# EAGLE design SparkFun_Noisy_Cricket (EAGLE 7.7.0)
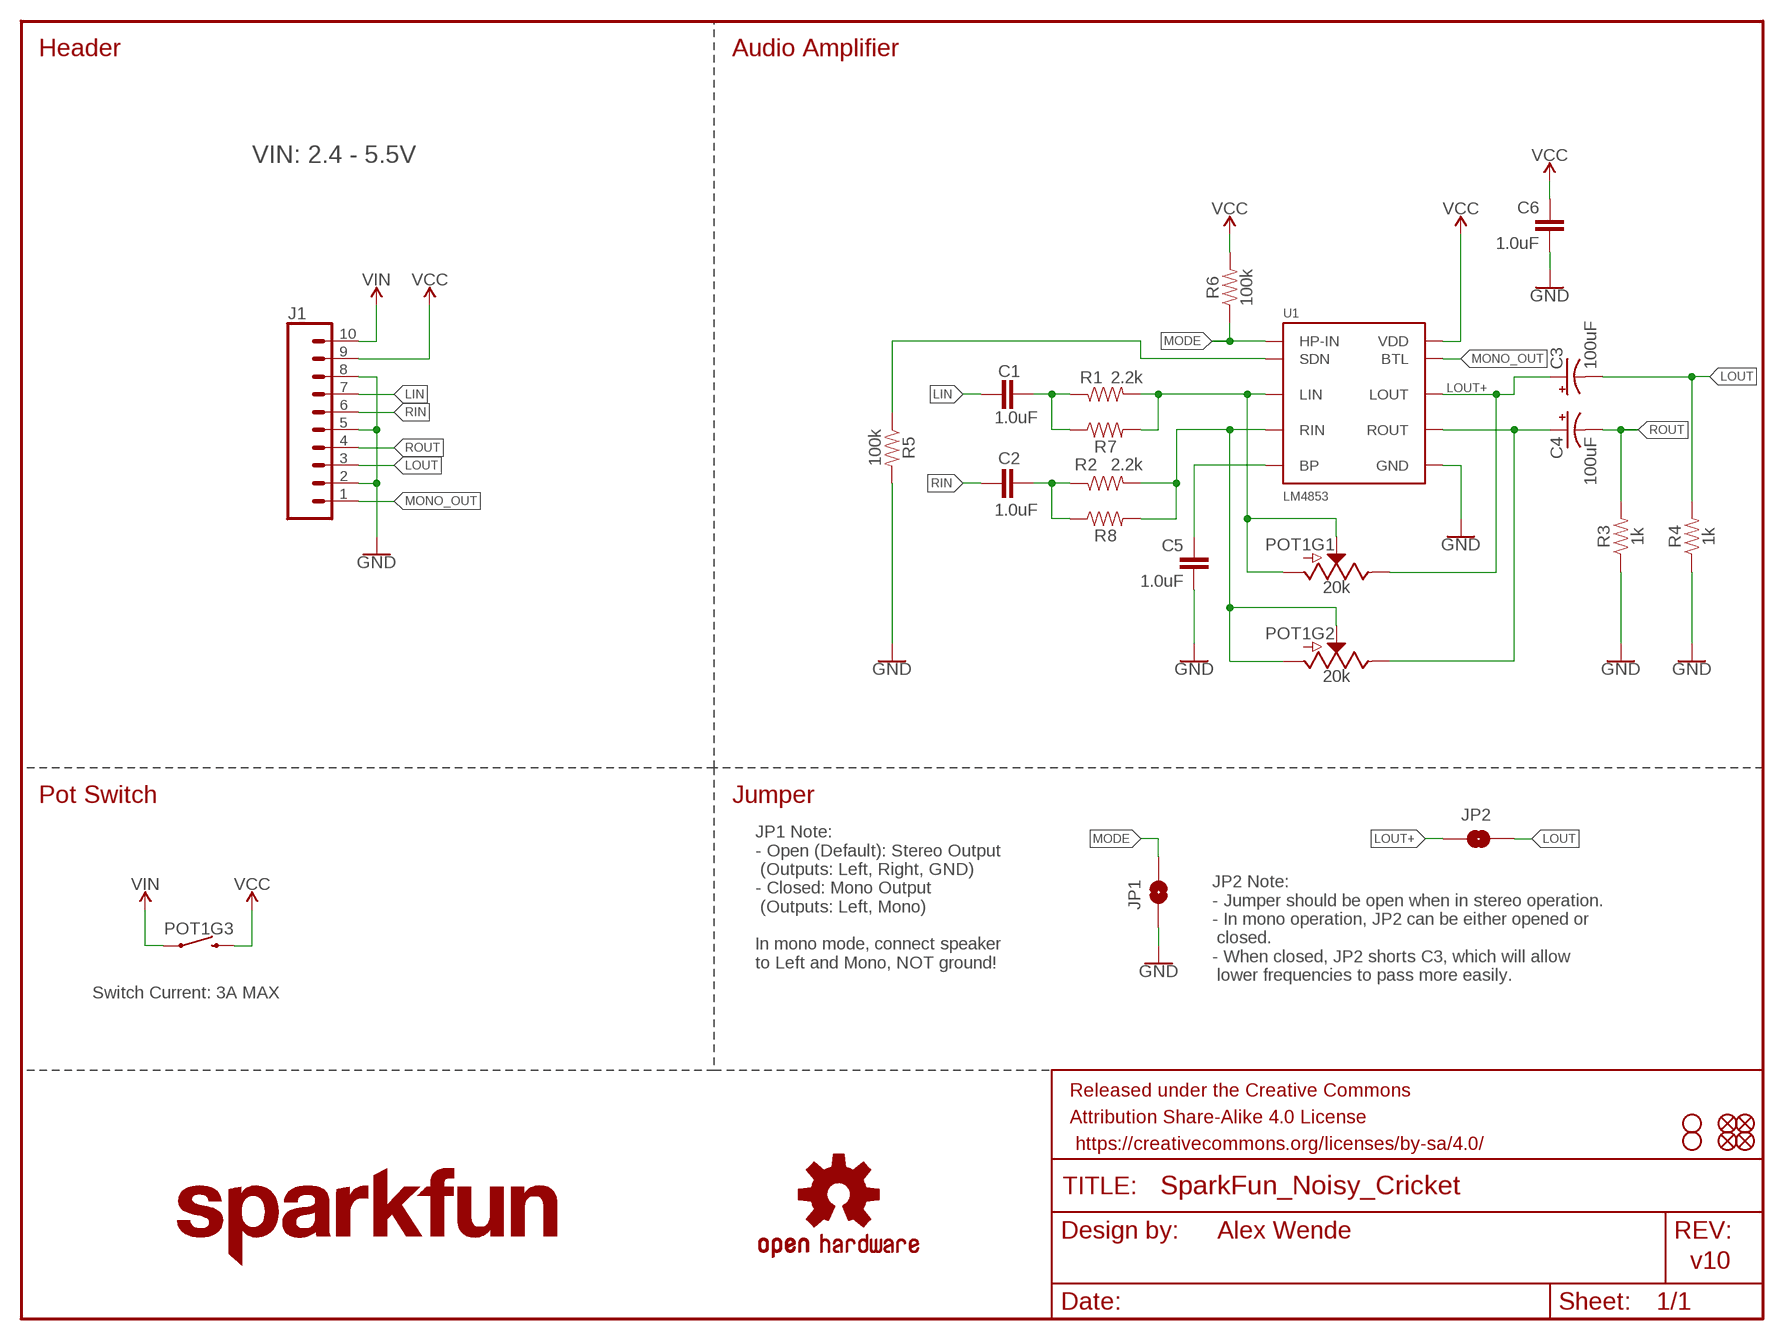
[diagram p0: schematic, sheet 1]

## Parts
C1  1.0uF  1.0UF-0603-16V-10%-X7R  [0603]
C2  1.0uF  1.0UF-0603-16V-10%-X7R  [0603]
C3  100uF  100UF-POLAR-25V-20%(ELEC)  [PANASONIC_D]
C4  100uF  100UF-POLAR-25V-20%(ELEC)  [PANASONIC_D]
C5  1.0uF  1.0UF-0603-16V-10%-X7R  [0603]
C6  1.0uF  1.0UF-0603-16V-10%-X7R  [0603]
FD1  FIDUCIALUFIDUCIAL  [FIDUCIAL-MICRO]
FD2  FIDUCIALUFIDUCIAL  [FIDUCIAL-MICRO]
FD3  FIDUCIALUFIDUCIAL  [FIDUCIAL-MICRO]
FD4  FIDUCIALUFIDUCIAL  [FIDUCIAL-MICRO]
FRAME1  FRAME-LETTER  [CREATIVE_COMMONS]
H1  STAND-OFF  [STAND-OFF]
H2  STAND-OFF  [STAND-OFF]
J1  CONN_10NO_SILK_PTH_FEMALE  [1X10_NO_SILK]
JP1  JUMPER-SMT_2_NO_NO-SILK  [SMT-JUMPER_2_NO_NO-SILK]
JP2  JUMPER-SMT_2_NO_NO-SILK  [SMT-JUMPER_2_NO_NO-SILK]
LOGO1  SFE_LOGO_NAME.1_INCH  [SFE_LOGO_NAME_.1]
LOGO2  OSHW-LOGOS  [OSHW-LOGO-S]
POT1  20k  POTENTIOMETER_DUAL_W/SWITCH  [POT-DUAL-SWITCH-PTH]
R1  2.2k  2.2KOHM-0603-1/10W-1%  [0603]
R2  2.2k  2.2KOHM-0603-1/10W-1%  [0603]
R3  1k  1KOHM-0603-1/10W-1%  [0603]
R4  1k  1KOHM-0603-1/10W-1%  [0603]
R5  100k  100KOHM-0603-1/10W-1%  [0603]
R6  100k  100KOHM-0603-1/10W-1%  [0603]
R7  RESISTORAXIAL-0.3-KIT  [AXIAL-0.3-KIT]
R8  RESISTORAXIAL-0.3-KIT  [AXIAL-0.3-KIT]
U1  LM4853  [TFSOP-10]

## Nets
5V: C6.1 J1.9 POT1.SW2 R6.2 U1.VDD ; supply symbol labelled VCC
GND: C5.2 C6.2 J1.2 J1.5 J1.8 JP1.1 R3.1 R4.1 R5.2 U1.GND
LIN: C1.1 J1.7
LOUT: C3.- J1.3 JP2.2 R4.2
LOUT+: C3.+ JP2.1 POT1.A3(E) U1.LOUT
MODE: JP1.2 R6.1 U1.HP-IN
MONO_OUT: J1.1 U1.BTL
N$3: C1.2 R1.1 R7.P$1
N$5: C5.1 U1.BP
N$6: C2.2 R2.1 R8.P$1
N$9: R5.1 U1.SDN
N$12: C4.+ POT1.B3(E) U1.ROUT
N$21: POT1.A1(A) POT1.A2(S) R1.2 R7.P$2 U1.LIN
N$24: POT1.B1(A) POT1.B2(S) R2.2 R8.P$2 U1.RIN
RIN: C2.1 J1.6
ROUT: C4.- J1.4 R3.2
VIN: J1.10 POT1.SW1

## Notes on the sheet
- Header | Audio Amplifier
- VIN: 2.4 - 5.5V
- Pot Switch | Jumper
- JP1 Note:
  - Open (Default): Stereo Output
   (Outputs: Left, Right, GND)
  - Closed: Mono Output
   (Outputs: Left, Mono)
  
  In mono mode, connect speaker 
  to Left and Mono, NOT ground!
- JP2 Note:
  - Jumper should be open when in stereo operation.
  - In mono operation, JP2 can be either opened or
   closed.
  - When closed, JP2 shorts C3, which will allow
   lower frequencies to pass more easily.
- Switch Current: 3A MAX
- Alex Wende
- v10

## Library data of the parts
C1 C2 C5 C6 = SparkFun-Capacitors:1.0UF: 1µF ceramic capacitors A capacitor is a passive two-terminal electrical component used to store electrical energy temporarily in an electric field.; PROD_ID: CAP-13930
C3 C4 = SparkFun-Capacitors:100UF-POLAR: 100µF polarized capacitors A capacitor is a passive two-terminal electrical component used to store electrical energy temporarily in an electric field.; PROD_ID: CAP-12547
FD1-FD4 = SparkFun-Aesthetics:FIDUCIAL: Fiducial Alignment Points Point-of-reference for pick-and-place machines and other optical instruments.
FRAME1 = SparkFun-Aesthetics:FRAME-LETTER: Schematic Frame - Letter Standard 8.5x11 US Letter frame
H1 H2 = SparkFun-Hardware:STAND-OFF: Stand Off Drill holes for mechanically mounting via screws, standoffs, etc. Note: Use the keepout ring to avoid running the screw head into surrounding components. Variant Overviews STAND-OFF - Mechanical footprint for a #4 phillips button head screw. STAND-OFF-TIGHT - Mechanical footprint for a #4 phillips button head screw, Example SparkFun Products Screw - Phillips Head (1/4", 4-40, 10 pack) <https://www.sparkfun.com/products/10453> (PRT-10453) Screw - Phillips Head (1/2", 4-40, 10 pack) <https://www.sparkfun.com/products/10452> (PRT-10452) Screw - Phillips Head (3/4", 4-40, 10 pack) <https://www.sparkfun.com/products/10451> (PRT-10451) Screw - Phillips Head (1", 4-40, 10 pack) <https://www.sparkfun.com/products/10450> (PRT-10450)
J1 = SparkFun-Connectors:CONN_10: Multi connection point. Often used as Generic Header-pin footprint for 0.1 inch spaced/style header connections On any of the 0.1 inch spaced packages, you can populate with these: Break Away Headers - Straight <https://www.sparkfun.com/products/116> (PRT-00116) Break Away Male Headers - Right Angle <https://www.sparkfun.com/products/553> (PRT-00553) Female Headers <https://www.sparkfun.com/products/115> (PRT-00115) Break Away Headers - Machine Pin <https://www.sparkfun.com/products/117> (PRT-00117) Break Away Female Headers - Swiss Machine Pin <https://www.sparkfun.com/products/743> (PRT-00743) Arduino Stackable Header - 10 Pin <https://www.sparkfun.com/products/11376> (PRT-11376) For SCREWTERMINALS and SPRING TERMINALS visit here: Screw Terimnals on SparkFun.com <https://www.sparkfun.com/search/results?term=Screw+Terminals> (5mm/3.5mm/2.54mm spacing) This device is also useful as a general connection point to wire up your design to another part of your project. Our various solder wires solder well into these plated through hole pads. Hook-Up Wire - Assortment (Stranded, 22 AWG) <https://www.sparkfun.com/products/11375> (PRT-11375) Hook-Up Wire - Assortment (Solid Core, 22 AWG) <https://www.sparkfun.com/products/11367> (PRT-11367) View the entire wire category on our website here <https://www.sparkfun.com/categories/141> Special notes: Molex polarized connector foot print use with SKU : PRT-08231 with associated crimp pins and housings. 1MM SMD Version SKU: PRT-10208 NOTES ON THE VARIANTS LOCK and LOCK_LONGPADS... This footprint was designed to help hold the alignment of a through-hole component (i.e. 6-pin header) while soldering it into place. You may notice that each hole has been shifted either up or down by 0.005 of an inch from it's more standard position (which is a perfectly straight line). This slight alteration caused the pins (the squares in the middle) to touch the edges of the holes. Because they are alternating, it causes a "brace" to hold the component in place. 0.005 has proven to be the perfect amount of "off-center" position when using our standard breakaway headers. Although looks a little odd when you look at the bare footprint, once you have a header in there, the alteration is very hard to notice. Also,if you push a header all the way into place, it is covered up entirely on the bottom side.; PROD_ID: CONN-11563
JP1 JP2 = SparkFun-Jumpers:JUMPER-SMT_2_NO: Normally open jumper This jumper has two pads in close proximity to each other. Apply solder to close the connection. Round pads are easier to solder for beginners, but are a lot larger. SparkFun Product that uses the round pads: SparkFun EL Sequencer <https://www.sparkfun.com/products/12781>
LOGO1 = SparkFun-Aesthetics:SFE_LOGO_NAME: SparkFun Font Logo This is the SparkFun name logo. The logo on the schematic will always be the same size; the package variant is the height of the flame part of the logo (or the height the flame would be, if it were drawn). Default layer for the logo on the board is tSilk.
LOGO2 = SparkFun-Aesthetics:OSHW-LOGO: Open-Source Hardware (OSHW) Logo This logo indicates the piece of hardware it is found on incorporates a OSHW license and/or adheres to the definition of open source hardware found here: http://freedomdefined.org/OSHW
POT1 = SparkFun-Resistors:POTENTIOMETER_DUAL_W/SWITCH; PROD_ID: RES-13814
R1 R2 = SparkFun-Resistors:2.2KOHM: 2.2kΩ resistor A resistor is a passive two-terminal electrical component that implements electrical resistance as a circuit element. Resistors act to reduce current flow, and, at the same time, act to lower voltage levels within circuits. - Wikipedia; PROD_ID: RES-08272
R3 R4 = SparkFun-Resistors:1KOHM: 1kΩ resistor A resistor is a passive two-terminal electrical component that implements electrical resistance as a circuit element. Resistors act to reduce current flow, and, at the same time, act to lower voltage levels within circuits. - Wikipedia; PROD_ID: RES-07856
R5 R6 = SparkFun-Resistors:100KOHM: 100kΩ resistor A resistor is a passive two-terminal electrical component that implements electrical resistance as a circuit element. Resistors act to reduce current flow, and, at the same time, act to lower voltage levels within circuits. - Wikipedia; PROD_ID: RES-07828
R7 R8 = SparkFun-Resistors:RESISTOR: Generic Resistor Package
U1 = SparkFun-IC-Amplifiers:LM4853; PROD_ID: IC-13812

## Board
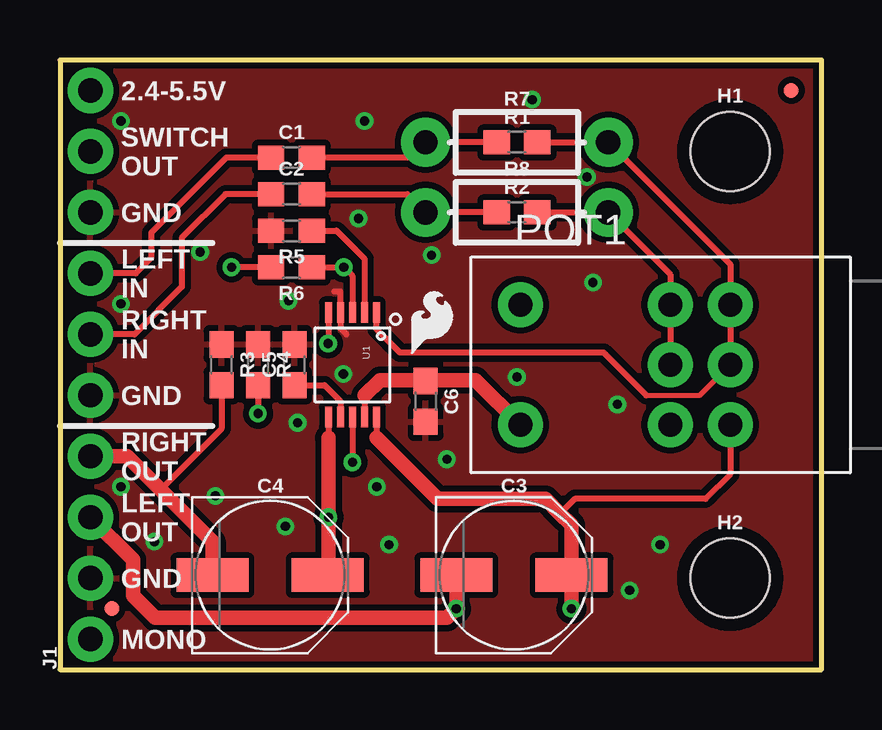
[diagram p1: board, top side]
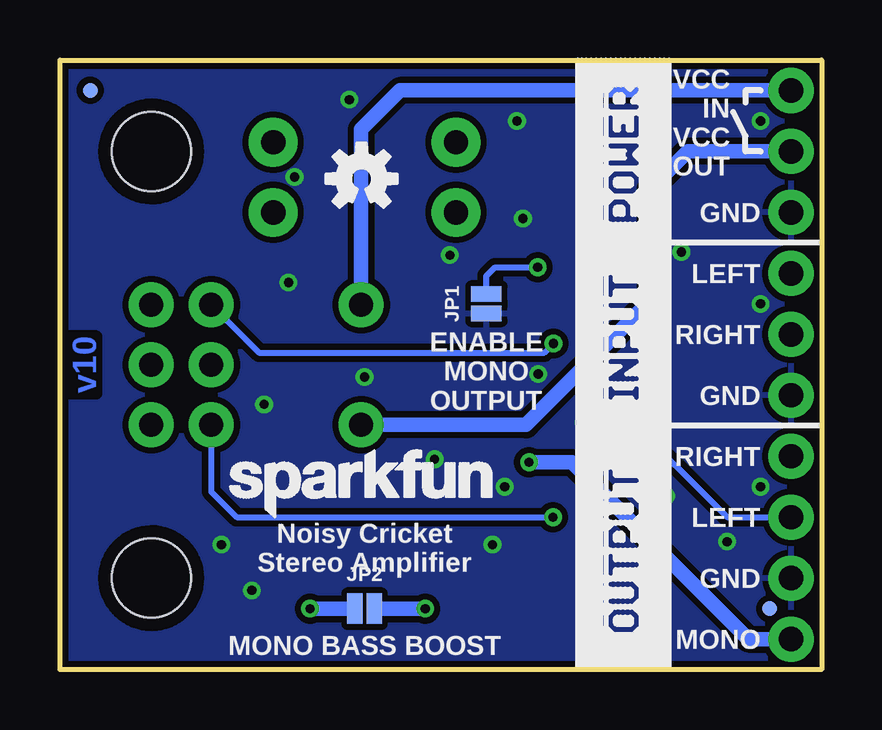
[diagram p2: board, bottom side, seen from below]

Size 31.75 x 25.4 mm. Coordinates in mm from the lower left corner, seen from the top.
Outline: 0,0 31.75,0 31.75,25.4 0,25.4 0,0
Copper layers (1*16): Top 0.035mm / dielectric 1.5mm / Bottom 0.035mm
Design rules "SparkFun-2-layer-TIGHT": minimum track width 7mil, minimum drill 15mil, track to track 7mil, track to pad 7mil, pad to pad 7mil, via to via 7mil, smd to smd 7mil, copper to edge 7mil, drill to drill 7mil, minimum pad ring 7mil, minimum via ring 7mil, stop-mask expansion 4mil, vias tented up to drill 25mil, thermal gap 10mil

### Footprints (pad centres in the part's own frame; a part is rotated, then mirrored left to right if it is on the bottom)
0603 = smd 1.1 x 1: 1 -0.85,0; 2 0.85,0
PANASONIC_D = smd 3 x 1.4: + 2.4,0; - -2.4,0
FIDUCIAL-MICRO = smd 0.635 x 0.635: 1 0,0
STAND-OFF = hole 3.302: 0,0
1X10_NO_SILK = drill 1.016 pad 1.88: 1 0,0; 2 2.54,0; 3 5.08,0; 4 7.62,0; 5 10.16,0; 6 12.7,0; 7 15.24,0; 8 17.78,0; 9 20.32,0; 10 22.86,0
SMT-JUMPER_2_NO_NO-SILK = smd 0.635 x 1.27: 1 -0.406,0; 2 0.406,0
POT-DUAL-SWITCH-PTH = drill 1 pad 1.88: A1 2.54,2.5; A2 2.54,0; A3 2.54,-2.5; B1 0.04,2.5; B2 0.04,0; B3 0.04,-2.5; SW1 -6.21,2.5; SW2 -6.21,-2.5
AXIAL-0.3-KIT = drill 1.016 pad 2.032: P$1 -3.81,0; P$2 3.81,0
TFSOP-10 = smd 0.85 x 0.29: BP 2.175,-0.5; BTL 2.175,0; GND -2.175,-0.5; HP-IN -2.175,0; LIN -2.175,1; LOUT 2.175,1; RIN -2.175,-1; ROUT 2.175,-1; SDN -2.175,0.5; VDD 2.175,0.5

### Placement (x,y rotation side)
C1  9.65,21.34 0 top
C2  9.65,19.81 0 top
C3  18.92,3.94 0 top
C4  8.76,3.94 0 top
C5  9.78,12.7 90 top
C6  15.24,11.18 270 top
FD1  2.16,2.54 0 top
FD2  30.48,24.13 0 top
FD3  2.16,2.54 0 bottom
FD4  30.48,24.13 0 bottom
FRAME1  -13.97,-19.05 0 top  (outside the outline)
H1  27.94,21.59 0 top
H2  27.94,3.81 0 top
J1  1.27,1.27 90 top
JP1  13.97,15.24 90 bottom
JP2  19.05,2.54 0 bottom
LOGO1  25.15,5.84 0 bottom
LOGO2  19.18,20.45 0 bottom
POT1  25.4,12.7 0 top
R1  19.05,21.97 0 top
R2  19.05,19.05 0 top
R3  6.73,12.7 270 top
R4  8.26,12.7 270 top
R5  9.65,18.29 180 top
R6  9.65,16.76 180 top
R7  19.05,21.97 0 top
R8  19.05,19.05 0 top
U1  12.19,12.7 270 top
U$1  [SFE_LOGO_FLAME_.1]  14.35,12.83 0 top

### Tracks (layer width: path | path; a pad name or v marks a point on that pad's centre or on a via)
5V  (via drill 0.38)
  Top 0.254: 12.7,11.43 U1.VDD | R6.2 v7.15,16.76
  Top 0.61: POT1.SW2 17.32,12.06 15.24,12.06 | 15.24,12.06 13.34,12.06 12.7,11.43 | 15.24,12.06 C6.1
  Bottom 0.61: J1.9 5.58,21.59 7.15,20.02 v7.15,16.76 7.15,15.37 12.32,10.2 POT1.SW2
GND  (via drill 0.38)
  Top 0.254: 11.43,15.75 11.69,15.75 U1.GND 11.69,14.22 11.94,13.97
  other vias: 2.54,15.24 21.97,20.52 15.49,17.27 19.05,12.19 11.81,12.32 2.54,7.62 3.94,5.33 9.4,5.97 6.48,7.24 9.91,10.29 9.53,15.37 12.45,18.8 5.84,17.4 2.54,22.86 12.7,22.86 19.68,23.75 23.24,11.05 16.13,8.76 13.21,7.62 13.72,5.21 22.23,16.13 25.02,5.21 23.75,3.3
  pour Bottom (isolate 0.254): 0,25.4 31.75,25.4 31.75,0 0,0
  pour Top (isolate 0.254): 0,25.4 31.75,25.4 31.75,0 0,0
LIN
  Top 0.254: C1.1 6.93,21.34 3.81,18.21 3.81,17.16 3.16,16.51 J1.7
LOUT  (via drill 0.38)
  Top 0.254: R4.2 v8.26,10.67
  Top 0.61: J1.3 3.05,4.57 3.05,3.08 3.96,2.16 16.14,2.16 v16.52,2.54 C3.-
  Bottom 0.254: J1.3 3.94,6.35 v8.26,10.67
  Bottom 0.61: JP2.2 v16.52,2.54
LOUT+  (via drill 0.38)
  Top 0.254: U1.LOUT 13.19,9.65 | POT1.A3 27.94,8.14 26.92,7.11 21.46,7.11 | 21.46,7.11 | 21.46,7.11 20.85,6.5
  Top 0.61: 13.19,9.65 13.21,9.65 15.75,7.11 20.24,7.11 20.85,6.5 21.32,6.03 C3.+ v21.32,2.54
  Bottom 0.61: v21.32,2.54 JP2.1
MODE  (via drill 0.38)
  Top 0.254: R6.1 v11.83,16.76 12.19,16.4 U1.HP-IN
  Bottom 0.254: JP1.2 13.97,16.41 13.61,16.76 v11.83,16.76
MONO_OUT  (via drill 0.38)
  Top 0.254: U1.BTL v12.19,8.64
  Bottom 0.61: v12.19,8.64 10.41,8.64 3.05,1.27 J1.1
N$3
  Top 0.254: R1.1 R7.P$1 14.61,21.34 C1.2
N$5
  Top 0.254: C5.1 11.03,11.85 11.69,11.19 U1.BP
N$6
  Top 0.254: R2.1 R8.P$1 14.48,19.81 C2.2
N$9
  Top 0.254: R5.1 11.53,18.29 12.69,17.12 U1.SDN
N$12  (via drill 0.38)
  Top 0.254: U1.ROUT 11.19,9.65
  Top 0.61: 11.19,9.65 v11.19,6.35 11.19,3.97 C4.+
  Bottom 0.254: POT1.B3 25.44,7.41 24.38,6.35 v11.19,6.35
N$21
  Top 0.203: 24.45,11.43 26.67,11.43 POT1.A2
  Top 0.254: R1.2 R7.P$2 27.94,16.89 POT1.A1 POT1.A2 | U1.LIN 13.19,14.19 14.17,13.21 22.67,13.21 24.45,11.43
N$24  (via drill 0.38)
  Top 0.254: R2.2 R8.P$2 25.44,16.47 POT1.B1 POT1.B2 | U1.RIN 11.19,13.61 v11.18,13.59
  Bottom 0.254: POT1.B1 23.45,13.21 11.56,13.21 v11.18,13.59
RIN
  Top 0.254: C2.1 6.9,19.81 5.08,17.99 5.08,15.95 3.1,13.97 J1.6
ROUT
  Top 0.254: R3.2 6.73,10.03 4.19,7.49
  Top 0.61: J1.4 2.79,8.89 4.19,7.49 6.36,5.32 C4.-
VIN
  Bottom 0.61: POT1.SW1 19.19,22.51 17.57,24.13 J1.10

### Text on the board
Bottom: v10
tPlace: 2.4-5.5V | SWITCH / OUT | GND | LEFT / IN | RIGHT / IN | GND | RIGHT / OUT | LEFT / OUT | GND | MONO
bPlace: VCC / IN | VCC / OUT | GND | LEFT | RIGHT | ENABLE / MONO / OUTPUT | GND | RIGHT | LEFT | Noisy Cricket / Stereo Amplifier | GND | MONO | MONO BASS BOOST
Measures: Units: Inches
tDocu: Alex Wende